# EAGLE design H10R4 (EAGLE 9.2.2)

## Sheet 1 of 2
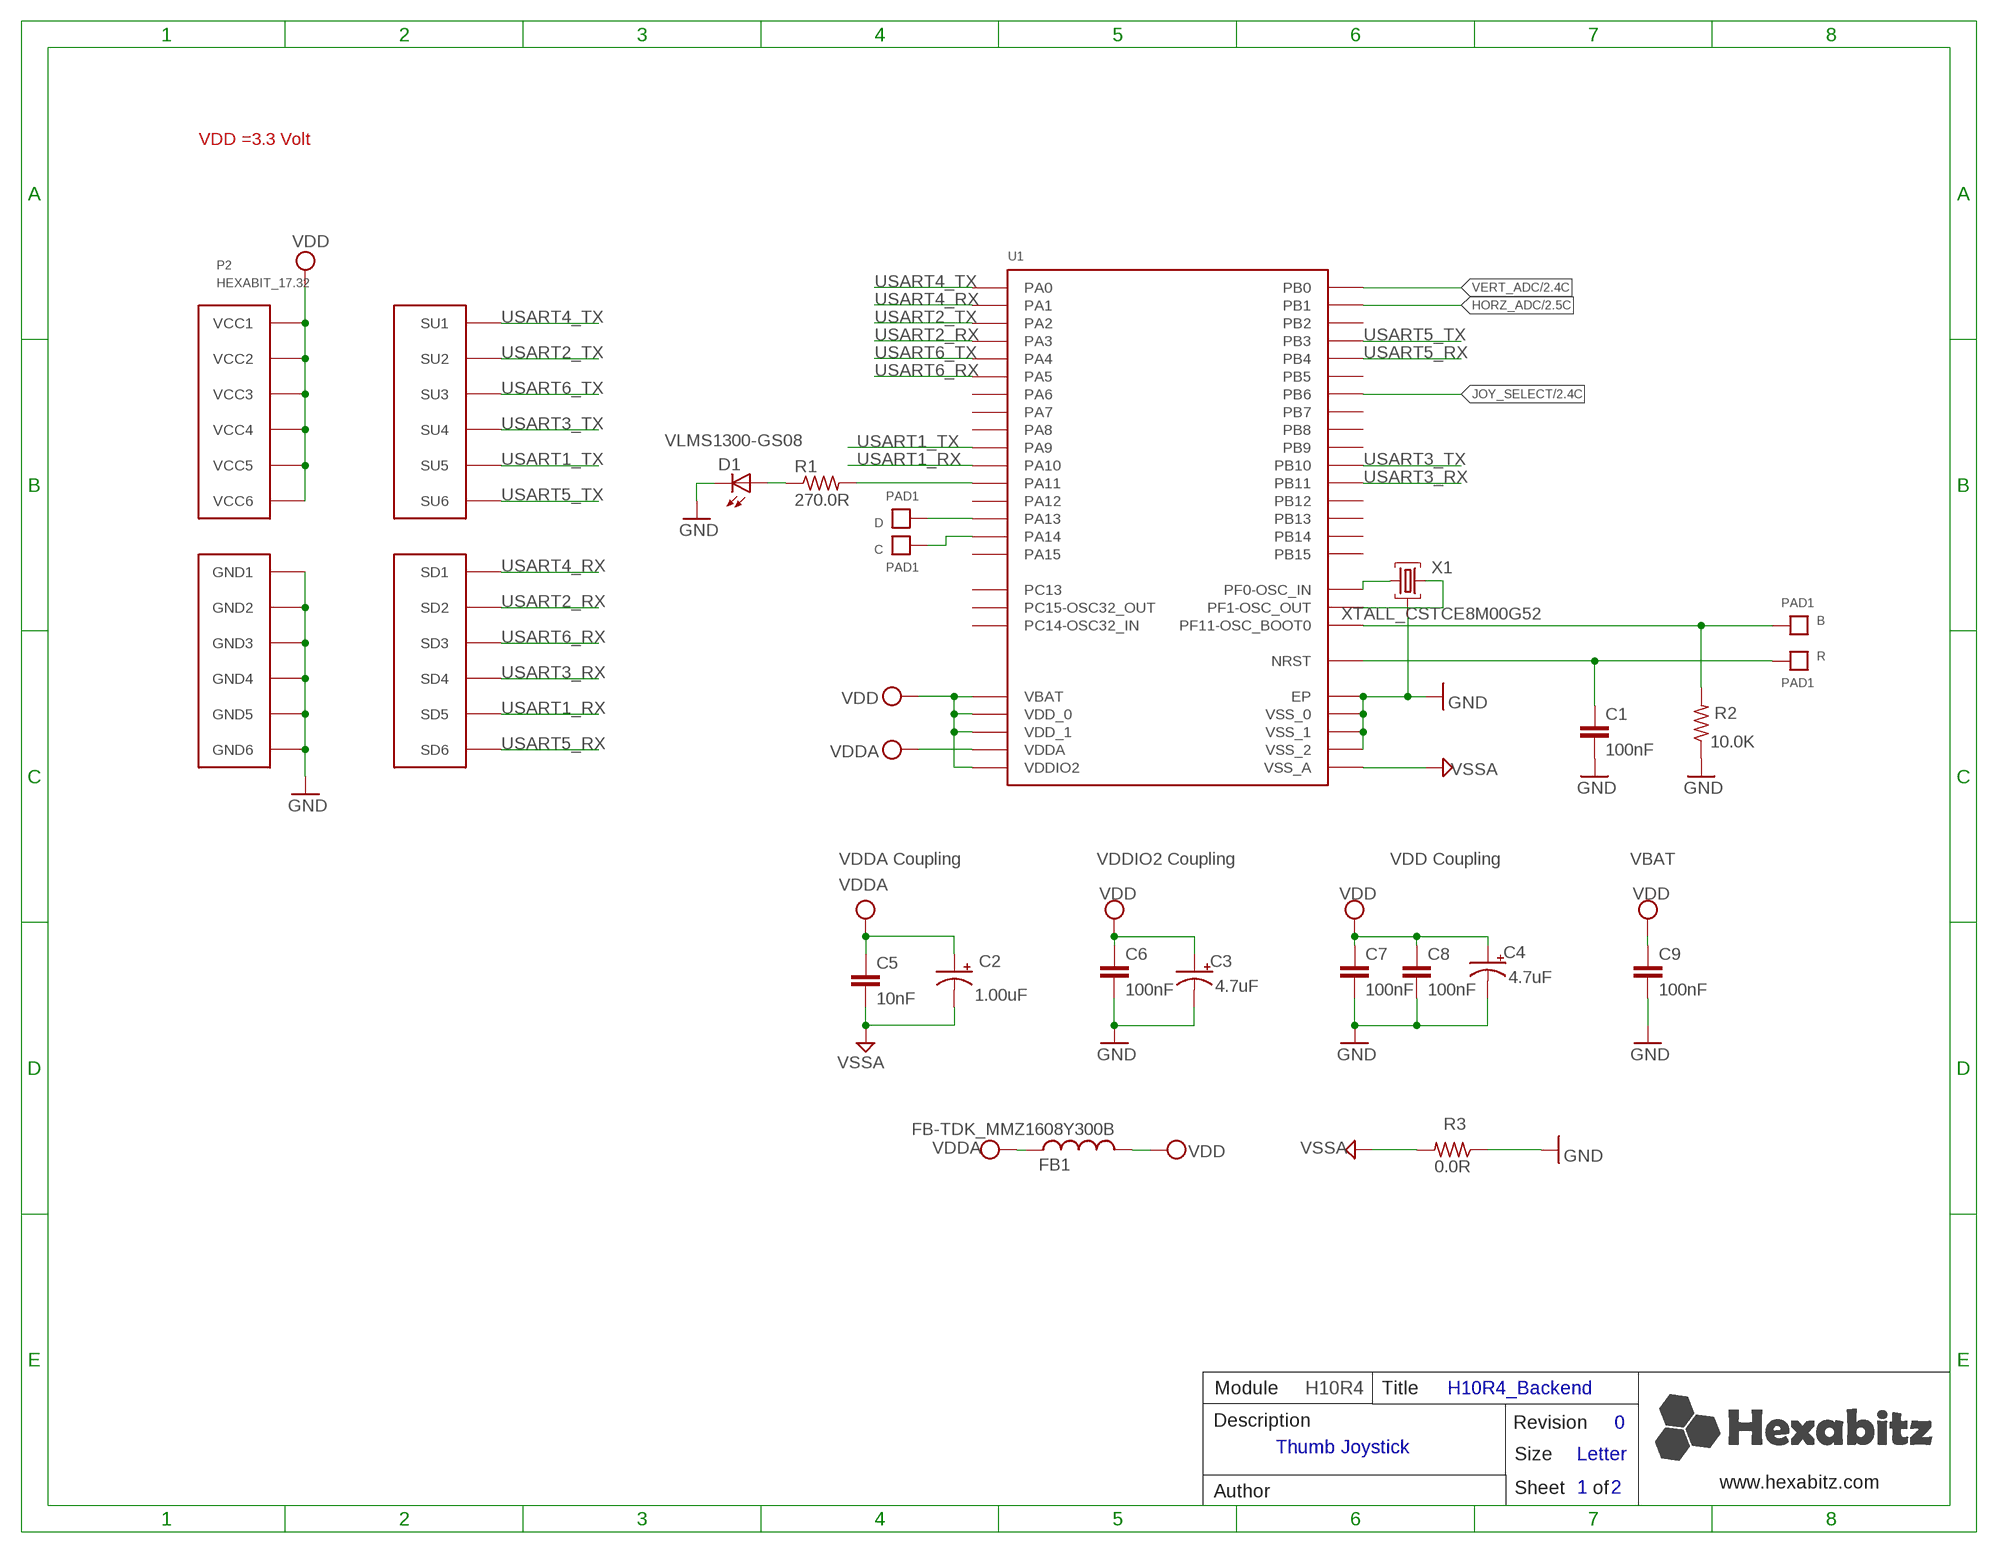
[diagram p0: schematic, sheet 1]

### Parts
B  PAD1  [PAD1]
C  PAD1  [PAD1]
C1  100nF  C-0603  [C-0603]
C2  1.00uF  C-0805-POL  [C-0805-POL]
C3  4.7uF  C-0805-POL  [C-0805-POL]
C4  4.7uF  C-0805-POL  [C-0805-POL]
C5  10nF  C-0603  [C-0603]
C6  100nF  C-0603  [C-0603]
C7  100nF  C-0603  [C-0603]
C8  100nF  C-0603  [C-0603]
C9  100nF  C-0603  [C-0603]
D  PAD1  [PAD1]
D1  VLMS1300-GS08  [VLMS1300-GS08]
FB1  FB-TDK_MMZ1608Y300B  [FB-TDK_MMZ1608Y300B]
P2  HEXABIT_17.32  [HEXABIT_17.32]
R  PAD1  [PAD1]
R1  270.0R  R-0603  [R-0603]
R2  10.0K  R-0603  [R-0603]
R3  0.0R  R-0603  [R-0603]
U1  STM32F091CBU6  [STM32F091CBU6]
X1  XTALL_CSTCE8M00G52  [XTALL_CSTCE8M00G52]

### Nets
B: B.P$1 B.P$2 R2.2 U1.P$44(PF11-OSC_BOOT0)
GND: C1.2 C3.2(-) C4.2(-) C6.2 C7.2 C8.2 C9.2 D1.C P2.7(GND1) P2.8(GND2) P2.9(GND3) P2.10(GND4) P2.11(GND5) P2.12(GND6) R2.1 R3.1 U1.EP U1.P$23(VSS_0) U1.P$35(VSS_1) U1.P$47(VSS_2) X1.P$2 ; also sheet 2
HORZ_ADC: U1.P$19(PB1) ; also sheet 2
JOY_SELECT: U1.P$42(PB6) ; also sheet 2
N$1: D.P$1 D.P$2 U1.P$34(PA13)
N$2: C.P$1 C.P$2 U1.P$37(PA14)
N$8: R1.2 U1.P$32(PA11)
N$10: D1.A R1.1
N$14: U1.P$5(PF0-OSC_IN) X1.P$1
N$15: U1.P$6(PF1-OSC_OUT) X1.P$3
R: C1.1 R.P$1 R.P$2 U1.P$7(NRST)
USART1_RX: P2.23(SD5) U1.P$31(PA10)
USART1_TX: P2.17(SU5) U1.P$30(PA9)
USART2_RX: P2.20(SD2) U1.P$13(PA3)
USART2_TX: P2.14(SU2) U1.P$12(PA2)
USART3_RX: P2.22(SD4) U1.P$22(PB11)
USART3_TX: P2.16(SU4) U1.P$21(PB10)
USART4_RX: P2.19(SD1) U1.P$11(PA1)
USART4_TX: P2.13(SU1) U1.P$10(PA0)
USART5_RX: P2.25(SD6) U1.P$40(PB4)
USART5_TX: P2.18(SU6) U1.P$39(PB3)
USART6_RX: P2.21(SD3) U1.P$15(PA5)
USART6_TX: P2.15(SU3) U1.P$14(PA4)
VDD: C3.1(+) C4.1(+) C6.1 C7.1 C8.1 C9.1 FB1.2 P2.1(VCC1) P2.2(VCC2) P2.3(VCC3) P2.4(VCC4) P2.5(VCC5) P2.6(VCC6) U1.P$1(VBAT) U1.P$24(VDD_0) U1.P$36(VDDIO2) U1.P$48(VDD_1)
VDDA: C2.1(+) C5.1 FB1.1 U1.P$9(VDDA) ; also sheet 2
VERT_ADC: U1.P$18(PB0) ; also sheet 2
VSSA: C2.2(-) C5.2 R3.2 U1.P$8(VSS_A) ; also sheet 2
Unconnected: U1.P$2(PC13) U1.P$3(PC14-OSC32_IN) U1.P$4(PC15-OSC32_OUT) U1.P$16(PA6) U1.P$17(PA7) U1.P$20(PB2) U1.P$25(PB12) U1.P$26(PB13) U1.P$27(PB14) U1.P$28(PB15) U1.P$29(PA8) U1.P$33(PA12) U1.P$38(PA15) U1.P$41(PB5) U1.P$43(PB7) U1.P$45(PB8) U1.P$46(PB9)

### Notes on the sheet
- VDD =3.3 Volt
- VDDA Coupling | VDDIO2 Coupling | VDD Coupling | VBAT
- Module | H10R4 | Title | H10R4_Backend
- Description | Revision | 0
- Thumb Joystick
- Size | Letter
- 1 | 2 | www.hexabitz.com
- Author | Sheet     of
- C:/Users/Admin/Desktop/logodraft.bmp

## Sheet 2 of 2
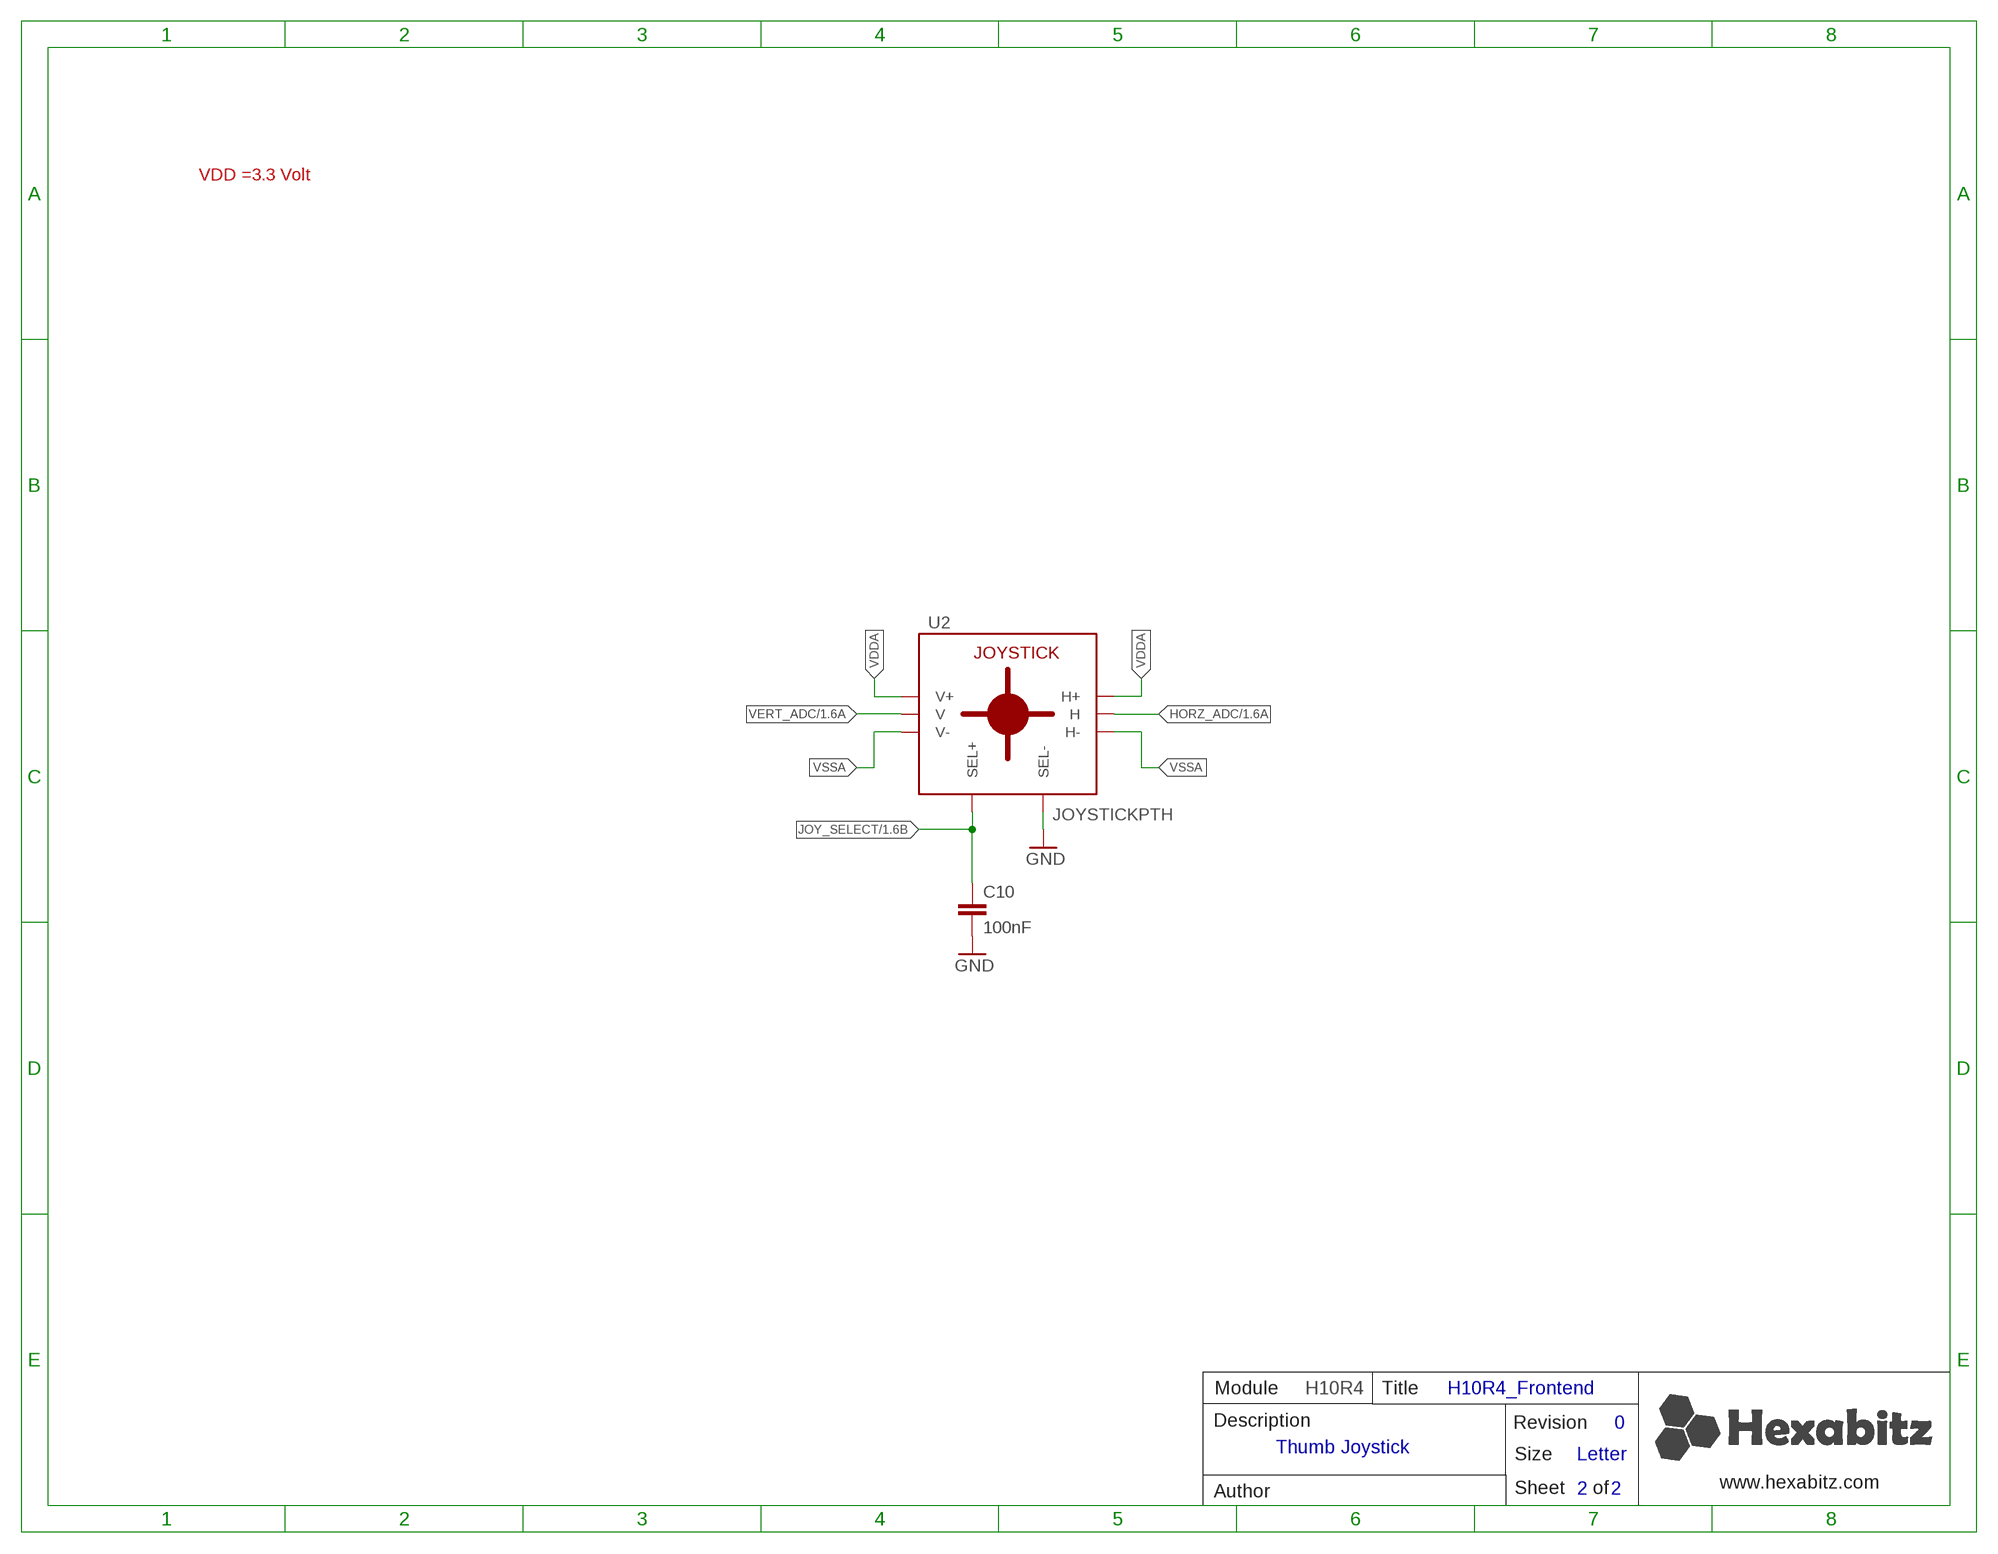
[diagram p1: schematic, sheet 2]

### Parts
C10  100nF  C-0603  [C-0603]
U2  JOYSTICKPTH  [JOYSTICK]

### Nets
GND: C10.2 U2.B2A(SEL-) ; also sheet 1
HORZ_ADC: U2.H2(H) ; also sheet 1
JOY_SELECT: C10.1 U2.B1A(SEL+) ; also sheet 1
VDDA: U2.H1(H+) U2.V1(V+) ; also sheet 1
VERT_ADC: U2.V2(V) ; also sheet 1
VSSA: U2.H3(H-) U2.V3(V-) ; also sheet 1

### Notes on the sheet
- VDD =3.3 Volt
- Module | H10R4 | Title | H10R4_Frontend
- Description | Revision | 0
- Thumb Joystick
- Size | Letter
- www.hexabitz.com
- Author | Sheet     of | 2 | 2
- C:/Users/Admin/Desktop/logodraft.bmp

## Library data of the parts
B C D R = Hexabitz:PAD1
C1 C6 C8 C10 = Hexabitz:C-0603: CAP CER 10% X7R 0603; CAPACITANCE: 100nF; MFN: KEMET; MPN: C0603C104K8RACTU; OCTOPART_URL: https://octopart.com/c0603c104k8ractu-kemet-145075?r=sp&s=9bS9ASSwSEqMCE9KBEQZ0g; TOLERANCE: 10%; VOLTAGE_RATING: 10V
C2 = Hexabitz:C-0805-POL: Cap Tant Solid SMD 2012; CAPACITANCE: 1.00uF; MFN: Yageo; MPN: CC0805KKX7R7BB105; OCTOPART_URL: https://octopart.com/cc0805kkx7r7bb105-yageo-8376555?r=sp&s=YKl1wwtkROau_X5nniH2ig; TOLERANCE: 10%; VOLTAGE_RATING: 16V
C3 C4 = Hexabitz:C-0805-POL: Cap Tant Solid SMD 2012; CAPACITANCE: 4.7uF; MFN: Murata; MPN: GRM21BC81E475KA12L; OCTOPART_URL: https://octopart.com/grm21bc81e475ka12l-murata-10331911?r=sp&s=RY3qZSD8T6mG6TC9CHI5qQ; TOLERANCE: 10%; VOLTAGE_RATING: 25V
C5 = Hexabitz:C-0603: CAP CER 10% X7R 0603; CAPACITANCE: 10nF; MFN: KEMET; MPN: C0603C103K5RACTU; OCTOPART_URL: https://octopart.com/c0603c103k5ractu-kemet-133094?r=sp&s=R_iPBxLnSmGqhkU2rIMFpg; TOLERANCE: 10%; VOLTAGE_RATING: 50V
C7 = Hexabitz:C-0603: CAP CER 10% X7R 0603; CAPACITANCE: 100nF; MFN: KEMET; MPN: C0603C104K8RACTU; OCTOPART_URL: https://octopart.com/c0603c104k8ractu-kemet-145075?r=sp&s=9bS9ASSwSEqMCE9KBEQZ0g; TOLERANCE: 10%; VOLTAGE_RATING: 10
C9 = Hexabitz:C-0603: CAP CER 10% X7R 0603; CAPACITANCE: 100nF; MFN: KEMET; MPN: C0603C104K8RACTU; OCTOPART_URL: https://octopart.com/c0603c104k8ractu-kemet-145075?r=sp&s=9bS9ASSwSEqMCE9KBEQZ0g; TOLERANCE: 10V; VOLTAGE_RATING: 10%
D1 = Hexabitz:VLMS1300-GS08: Red 0603 130° Clear 54 mcd 2 V Surface Mount ChipLED ; Octopart Url : http://octopart.com/vlms1300-gs08-vishay-21709201; MFN: Vishay; MPN: VLMS1300-GS08; OCTOPART_URL: https://octopart.com/vlms1300-gs08-vishay-21709201?r=sp&s=_gcP4_q8T1SC6PJQPTQ9yA
FB1 = Hexabitz:FB-TDK_MMZ1608Y300B: Ferrite Beads Multi-Layer 30Ohm 25% 100MHz 1.5A 50mOhm DCR 0603; MFN: TDK; MPN: MMZ1608Y300B; OCTOPART_URL: https://octopart.com/mmz1608y300b-tdk-368280?r=sp&s=cd9_2ZEqQ9q9UNBuQgHAiA
P2 = Hexabitz:HEXABIT_17.32: HEXABIT CONNECTOR
R1 = Hexabitz:R-0603: Thick Film Resistors - SMD 0603; MFN: Yageo; MPN: RC0603FR-07270RL; OCTOPART_URL: https://octopart.com/search?q=RC0603FR-07270RL&start=0; RESISTANCE: 270.0 Ohm; TOLERANCE: 1%
R2 = Hexabitz:R-0603: Thick Film Resistors - SMD 0603; MFN: Yageo; MPN: RC0603JR-0710KL; OCTOPART_URL: https://octopart.com/search?q=RC0603JR-0710KL&start=0; RESISTANCE: 10.0K Ohm; TOLERANCE: 5%
R3 = Hexabitz:R-0603: Thick Film Resistors - SMD 0603; MFN: Yageo; MPN: RC0603JR-070RL; OCTOPART_URL: https://octopart.com/rc0603jr-070rl-yageo-1241539?r=sp&s=X2NteqRjRNWrnx42Y0aliA; RESISTANCE: 0.0 Ohm
U1 = Hexabitz:STM32F091CBU6: Description : ARM-based 32-bit MCU, CAN, 12 timers, ADC, DAC & Comm. Interface, 2 to 3.6 V, -40 to 85 degC, 48-Pin UFQFPN, RoHS, Tray ;Parameter : Ciiva URL : https://ciiva.com/part/STM32F091CBU6-20240708, CiivaID : 20240708, Clock Speed : 48000000.0 Hz, Lifecycle Status : Active, Mounting Style : Surface Mount, Number of Pins : 48, Octopart Url : https://octopart.com/stm32f091cbu6-stmicroelectronics-51988677, OctopartID : 5f4f955c32ec8088, RAM Memory Size : 32768 B, REACH SVHC Compliance : No SVHC, RoHS : Compliant,; MFN: STMicroelectronics; MPN: STM32F091CBU6; OCTOPART_URL: https://octopart.com/stm32f091cbu6-stmicroelectronics-51988677?r=sp&s=bU6fpgsrTZOxHyt7jkfh3w
U2 = Hexabitz:JOYSTICK: Thumb Joystick Joystick commonly found in PS2 controllers. Two pots and a select switch. Footprint proven. Spark Fun Electronics SKU : COM-09032; MFN: SparkFun; MPN: COM-09032; OCTOPART_URL: https://octopart.com/search?q=COM-09032&start=0
X1 = Hexabitz:XTALL_CSTCE8M00G52: MURATA CSTCE8M00G52-R0 RESONATOR, SMD, 8MHZ ; Octopart Url : https://octopart.com/cstce8m00g52-r0-murata-7145559; MFN: Murata; MPN: CSTCE8M00G52Z-R0; OCTOPART_URL: https://octopart.com/cstce8m00g52z-r0-murata-17755941?r=sp&s=JDnNJnrHQhyS8Zk4ofFWXw

## Board
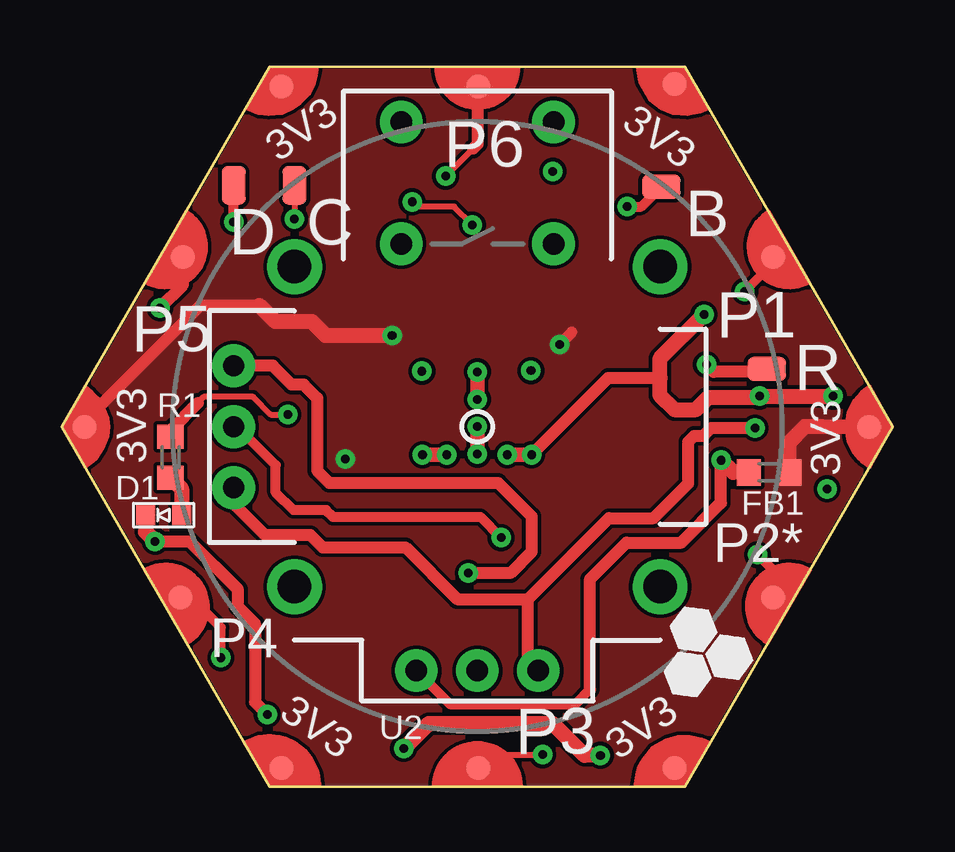
[diagram p2: board, top side]
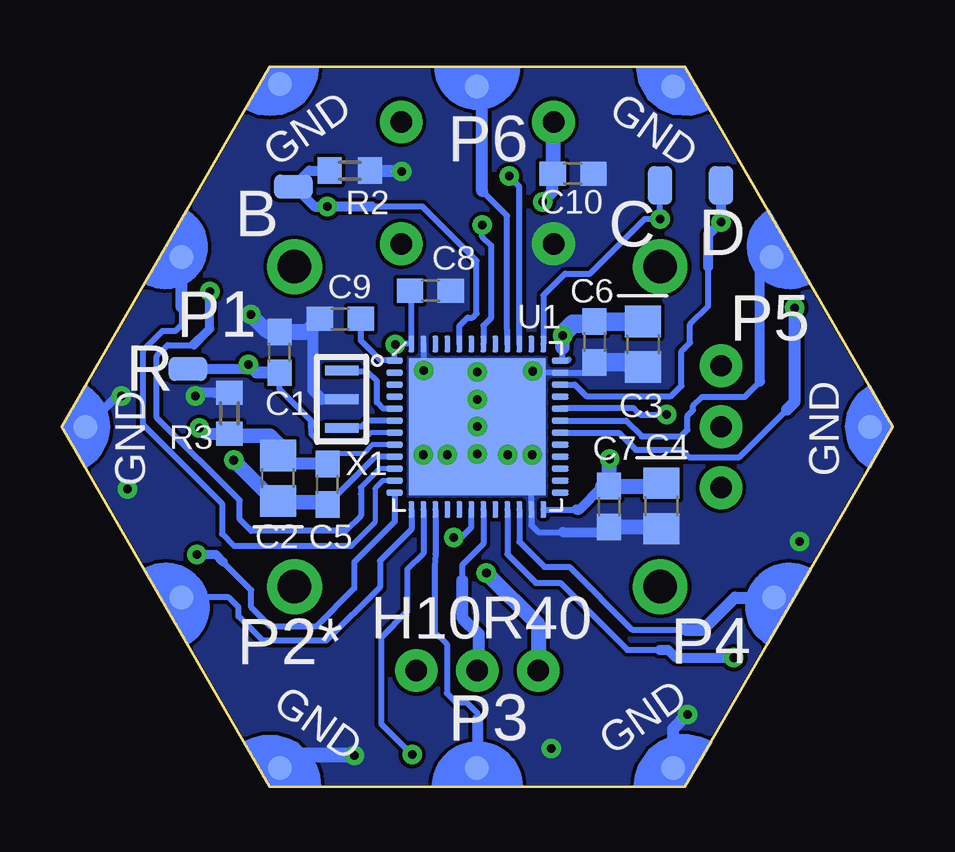
[diagram p3: board, bottom side, seen from below]

Size 34.64 x 30 mm. Coordinates in mm from the lower left corner, seen from the top.
Copper layers (1*16): Top 0.035mm / dielectric 1.5mm / Bottom 0.035mm
Design rules "default *": minimum track width 7mil, minimum drill 10mil, track to track 6mil, track to pad 6mil, pad to pad 6mil, via to via 6mil, smd to smd 0mil, copper to edge 1mil, drill to drill 8mil, minimum pad ring 10mil, minimum via ring 8mil, stop-mask expansion 2mil, vias tented up to drill 15mil, thermal gap 10mil

### Footprints (pad centres in the part's own frame; a part is rotated, then mirrored left to right if it is on the bottom)
PAD1 = smd 1.6 x 1: P$1 0,0 | smd 1.6 x 1 bottom: P$2 0,0
C-0603 = smd 1.1 x 1: 1 -0.85,0; 2 0.85,0
C-0805-POL = smd 1.3 x 1.5: 1 -0.95,0; 2 0.95,0
VLMS1300-GS08 = smd 0.8 x 0.8: A 0,0.75; C 0,-0.75
FB-TDK_MMZ1608Y300B = smd 1 x 1.1: 1 -0.85,0; 2 0.85,0
HEXABIT_17.32 = smd 1 x 1: 1 8.23,14.28; 2 16.33,-0.02; 3 8.23,-14.22; 4 -8.17,-14.22; 5 -16.37,-0.02; 6 -8.17,14.18; 13 12.33,7.08; 14 12.33,-7.12; 15 0.03,-14.22; 16 -12.37,-7.12; 17 -12.27,7.08; 18 0.03,14.18 | smd 1 x 1 bottom: 7 8.23,14.28; 8 16.33,-0.02; 9 8.23,-14.22; 10 -8.17,-14.22; 11 -16.37,-0.02; 12 -8.17,14.18; 19 12.33,7.08; 20 12.33,-7.12; 21 0.03,-14.22; 22 -12.37,-7.12; 23 -12.27,7.08; 25 0.03,14.18
R-0603 = smd 1 x 1.1: 1 -0.85,0; 2 0.85,0
STM32F091CBU6 = smd 5.7 x 5.7: EP 0,0 | smd 0.25 x 0.7: P$1 -2.75,-3.45; P$2 -2.25,-3.45; P$3 -1.75,-3.45; P$4 -1.25,-3.45; P$5 -0.75,-3.45; P$6 -0.25,-3.45; P$7 0.25,-3.45; P$8 0.75,-3.45; P$9 1.25,-3.45; P$10 1.75,-3.45; P$11 2.25,-3.45; P$12 2.75,-3.45; P$25 2.75,3.45; P$26 2.25,3.45; P$27 1.75,3.45; P$28 1.25,3.45; P$29 0.75,3.45; P$30 0.25,3.45; P$31 -0.25,3.45; P$32 -0.75,3.45; P$33 -1.25,3.45; P$34 -1.75,3.45; P$35 -2.25,3.45; P$36 -2.75,3.45 | smd 0.7 x 0.25: P$13 3.45,-2.75; P$14 3.45,-2.25; P$15 3.45,-1.75; P$16 3.45,-1.25; P$17 3.45,-0.75; P$18 3.45,-0.25; P$19 3.45,0.25; P$20 3.45,0.75; P$21 3.45,1.25; P$22 3.45,1.75; P$23 3.45,2.25; P$24 3.45,2.75; P$37 -3.45,2.75; P$38 -3.45,2.25; P$39 -3.45,1.75; P$40 -3.45,1.25; P$41 -3.45,0.75; P$42 -3.45,0.25; P$43 -3.45,-0.25; P$44 -3.45,-0.75; P$45 -3.45,-1.25; P$46 -3.45,-1.75; P$47 -3.45,-2.25; P$48 -3.45,-2.75
JOYSTICK = drill 0.9 pad 1.778: B1A -3.175,12.7; B1B 3.175,12.7; B2A -3.175,7.62; B2B 3.175,7.62 | drill 0.889 pad 1.778: H1 -2.54,-10.16; H2 0,-10.16; H3 2.54,-10.16; V1 -10.16,2.54; V2 -10.16,0; V3 -10.16,-2.54 | drill 1.397 pad 2.286: MOUNT1 -7.62,6.668; MOUNT2 -7.62,-6.668; MOUNT3 7.62,-6.668; MOUNT4 7.62,6.668
XTALL_CSTCE8M00G52 = smd 1.4 x 0.4: P$1 0,1.2; P$2 0,0; P$3 0,-1.2

### Placement (x,y rotation side)
B  24.99,25.01 0 top
C  9.7,25.06 270 top
C1  25.57,18.1 90 bottom
C2  25.63,12.85 90 bottom
C3  10.41,18.44 270 bottom
C4  9.65,11.7 270 bottom
C5  23.57,12.6 90 bottom
C6  12.44,18.53 270 bottom
C7  11.83,11.67 270 bottom
C8  19.28,20.66 0 bottom
C9  23.04,19.5 180 bottom
C10  13.33,25.54 0 bottom
D  7.16,25.06 90 top
D1  4.24,11.32 270 top
FB1  29.48,13.1 0 top
P2  17.32,15 0 top
R  29.39,17.41 0 top
R1  4.53,13.73 90 top
R2  22.64,25.67 180 bottom
R3  27.66,15.56 270 bottom
U1  17.32,15 270 bottom
U2  17.32,15 0 top
X1  22.98,16.14 0 bottom

### Tracks (layer width: path | path; a pad name or v marks a point on that pad's centre or on a via)
B  (via drill 0.36 pad 0.81)
  Top 0.406: v23.57,24.17 24.15,24.17 B.P$1
  Bottom 0.254: U1.P$44 18.07,19.2 17.73,19.55 17.52,19.55 17.34,19.72 17.34,21.91 19.61,24.17 21.71,24.17
  Bottom 0.406: R2.2 24.33,25.67 B.P$1 24.94,25.01 24.1,24.17 v23.57,24.17 21.71,24.17
  Bottom 0.508: B.P$1 arc90 24.96,24.98
GND  (via drill 0.36 pad 0.81)
  Top 0.508: v3.88,10.22 5.33,10.22 7.34,8.22 7.34,7.51 8.05,6.8 8.05,3.52 v8.56,3.01 | v19.58,13.83 22.78,17.03 24.94,17.03
  Top 0.61: v17.32,13.86 U1.EP | v17.32,16.14 v17.32,17.29 | v15.03,13.83 v16.05,13.83 | v19.58,13.83 v18.57,13.83
  Top 0.635: D1.C 3.49,10.62 v3.88,10.22 | v26.77,19.67 24.94,17.84 24.94,17.03 24.94,16.3 25.52,15.71 26.44,15.71 26.95,16.22 29.03,16.22 v29.08,16.27 v32.15,16.27 | v22.45,1.31 21.79,1.31 20.47,2.63 15.29,2.63 v14.25,1.59
  Bottom 0.254: U1.P$47 19.57,17.25 U1.EP | v15.03,13.83 15,17.25 U1.P$35 12.62,17.25 C6.2 | v16.05,13.83 16.3,17.29 | v17.32,13.86 16.68,13.22 15.29,13.22 15.07,13 U1.P$23 15.07,10.9 14.78,10.61 13.76,10.61
  Bottom 0.356: X1.P$2 23.8,16.14
  Bottom 0.381: R3.1 28.26,16.41 | v32.15,16.27 32.36,16.27 P2.8
  Bottom 0.406: 13.76,10.61 12.05,10.61 C7.2 | 28.26,16.41 28.94,16.41 v29.08,16.27
  Bottom 0.457: 23.8,16.14 24.18,16.52 24.18,19.2 C9.2 | 19.57,17.25 19.39,17.25 v19.58,13.83 | v18.57,13.83 18.08,17.29
  Bottom 0.508: P2.10 9.15,2.42 v8.56,3.01 | R2.1 20.5,25.67 v20.47,25.64
  Bottom 0.61: 24.99,18.94 C1.2 | v17.32,13.86 U1.EP v17.32,16.14 | v17.32,17.29 16.3,17.29
  Bottom 0.635: C7.2 9.82,10.82 C4.2 | 24.99,18.94 24.44,18.94 C9.2 23.89,19.48 24.41,18.96 26.06,18.96 v26.77,19.67 | v22.45,1.31 25.02,1.31 P2.9
  Bottom 0.762: 10.47,17.4 C3.2 10.58,17.68 C6.2
  other vias: 17.32,15 19.56,17.34 31.9,12.41 15.01,17.31
  pour Bottom (no thermals): 0.05,15 8.68,29.99 25.96,29.99 34.59,15 25.96,0.01 8.68,0.01
HORZ_ADC
  Bottom 0.254: U1.P$19 17.07,10.12 17.95,9.23 17.95,8.6
  Bottom 0.508: 17.95,8.6 17.95,7.05 17.27,6.36 17.27,4.89 U2.H2
JOY_SELECT  (via drill 0.36 pad 0.81)
  Top 0.254: v17.12,23.41 16.36,24.17 14.8,24.17 v14.6,24.37
  Bottom 0.254: v17.12,23.41 17.12,22.93 16.74,22.54 16.74,19.55 17.07,19.22 U1.P$42
  Bottom 0.508: v14.6,24.37 14.18,24.79 C10.1
  Bottom 0.635: C10.1 14.14,25.58 U2.B1A
N$1  (via drill 0.36 pad 0.81)
  Top 0.406: v7.16,23.53 D.P$1
  Bottom 0.254: 7.69,21.66 7.69,20.03 8.46,19.27 8.46,18.5 8.81,18.15 8.81,16.7 9.24,16.27 12.77,16.27 13.25,16.75 U1.P$34
  Bottom 0.406: 7.69,21.66 7.69,23 v7.16,23.53 D.P$1
N$2  (via drill 0.36 pad 0.81)
  Top 0.254: C.P$1 v9.7,23.66
  Bottom 0.254: C.P$1 v9.7,23.66 10.34,23.66 12.62,21.38 13.66,21.38 14.57,20.47 U1.P$37
N$8  (via drill 0.36 pad 0.81)
  Top 0.254: 5.66,15.99 5.92,16.25 7.97,16.25 8.71,15.51 v9.42,15.51
  Top 0.508: 5.66,15.99 4.53,14.86 R1.2
  Bottom 0.254: U1.P$32 13.86,15.76 10.79,15.76 10.54,15.51 v9.42,15.51
N$10
  Top 0.635: R1.1 4.99,12.42 D1.A
N$14
  Bottom 0.254: U1.P$5 21.25,15.75 21.51,16.02 21.51,16.91 21.89,17.29 22.92,17.29 X1.P$1
N$15
  Bottom 0.254: U1.P$6 21.9,15.25 22.15,15 22.92,15 X1.P$3
R  (via drill 0.36 pad 0.81)
  Top 0.406: 29.26,17.29 R.P$1
  Top 0.508: 29.26,17.29 27.18,17.29 v26.87,17.59
  Bottom 0.203: U1.P$7 21.76,14.75 22.09,14.42 23.98,14.42 24.25,14.7 24.25,14.97
  Bottom 0.254: 26.91,17.45 v26.87,17.59 | 24.25,14.97 24.25,15.25 25.57,16.57 C1.1
  Bottom 0.406: R.P$1 27.05,17.41 v26.87,17.59
  Bottom 0.508: C1.1 26.53,17.25 v26.87,17.59
USART1_RX
  Bottom 0.254: U1.P$31 11.12,15.25 10.46,14.59 8.84,14.59 8.56,14.87 8.56,15.46 8.33,15.69 8.33,15.86 7.95,16.25 6.17,16.25 5.53,16.88
  Bottom 0.406: 5.53,16.88 5.53,21.6 5.05,21.6
  Bottom 0.508: P2.23 5.05,21.6
USART1_TX  (via drill 0.36 pad 0.81)
  Top 0.254: 4.84,22.08 P2.17
  Top 0.457: 4.84,22.08 4.37,21.6
  Top 0.508: v4.09,19.95 5.05,20.92 P2.17
  Bottom 0.254: U1.P$30 11.43,14.75 10.72,14.04 8.81,14.04 8.51,13.73 6.4,13.73 4.42,15.71
  Bottom 0.508: 4.42,15.71 4.09,16.04 v4.09,19.95
USART2_RX
  Bottom 0.254: U1.P$13 20.07,10.73 21.38,9.41 21.38,8.32 23.62,6.08 26.26,6.08 27.28,7.1 27.28,7.48 27.68,7.89 P2.20
  Bottom 0.406: P2.20 29.48,7.88 29.48,7.71
USART2_TX  (via drill 0.36 pad 0.81)
  Top 0.406: v29,9.67 29.65,9.02 P2.14
  Bottom 0.254: U1.P$12 20.77,11.04 22.45,9.36 22.45,8.27 24.05,6.67 25.93,6.67 26.74,7.48 26.74,8.19 27.91,9.36
  Bottom 0.381: 27.91,9.36 28.22,9.67 v29,9.67
USART3_RX
  Bottom 0.254: U1.P$22 15.57,10.2 14.53,9.16 13.48,9.16 10.87,6.54 8.66,6.54
  Bottom 0.508: 4.95,8.14 P2.22 6.58,7.88 7.91,6.54 8.66,6.54
USART3_TX  (via drill 0.36 pad 0.81)
  Top 0.406: 4.95,7.79 5.23,7.51 5.23,7.58 4.98,7.84 | 4.98,7.84 4.99,7.84 | 4.98,7.84 4.95,7.84 | v6.63,5.37 6.63,6.64 5.39,7.88 P2.16
  Top 0.508: P2.16 4.95,7.84
  Bottom 0.254: U1.P$21 16.07,9.69 14.88,8.5 13.87,8.5 11.07,5.7 9.72,5.7
  Bottom 0.406: 9.72,5.7 9.37,5.7 9.04,5.37 v6.63,5.37
USART4_RX
  Bottom 0.203: U1.P$11 21.27,12.75 21.59,12.44 21.59,11.01 22.58,10.02
  Bottom 0.254: 22.58,10.02 27.45,10.02 27.96,10.53 27.96,11.8 31.27,15.1 31.27,18.18 30.45,18.99 29.92,18.99 29.65,19.26 29.65,20.02
  Bottom 0.508: 29.65,20.02 P2.19
USART4_TX  (via drill 0.36 pad 0.81)
  Top 0.381: v28.47,20.64 29.65,21.82
  Top 0.508: 29.65,21.82 P2.13
  Bottom 0.203: U1.P$10 21.41,13.25 22.17,12.48 22.17,12.21
  Bottom 0.254: 22.17,12.46 22.17,12.21 22.17,11.29 22.81,10.66 26.74,10.66 27.23,11.14 27.23,11.93 30.68,15.38 30.68,17.95 30.22,18.4 29.16,18.4 29.13,18.43
  Bottom 0.381: v28.47,20.64 28.47,19.09 28.95,18.61
  Bottom 0.406: 28.95,18.61 29.13,18.43
USART5_RX
  Bottom 0.254: U1.P$40 16.07,19.03 16.07,19.04 16.07,23.79 17.12,24.83
  Bottom 0.508: 17.12,24.83 17.12,28.95 P2.25
USART5_TX  (via drill 0.36 pad 0.81)
  Top 0.254: v16,25.44 17.14,26.58
  Top 0.508: 17.14,26.58 17.34,26.79 P2.18
  Bottom 0.254: U1.P$39 15.57,24.81 | 15.57,24.8 15.57,24.81 | 15.57,24.81 15.57,25.01 v16,25.44
USART6_RX
  Bottom 0.254: U1.P$15 19.07,9.69 19.1,9.16 19.1,6.44 18.59,5.93 18.59,3.9 18.21,3.52 17.78,3.52 17.32,3.06 17.32,2.81 | 17.32,0.81 P2.21
  Bottom 0.406: 17.32,0.81 17.35,0.81
  Bottom 0.457: 17.32,2.81 17.32,0.81
USART6_TX  (via drill 0.36 pad 0.81)
  Top 0.254: P2.15 17.91,1.33 v20.04,1.33
  Bottom 0.254: U1.P$14 19.57,9.73 20.24,9.06 20.24,7.3 21.33,6.21 21.33,2.63 v20.04,1.33
VDD  (via drill 0.36 pad 0.81)
  Top 0.457: v20.75,18.43 21.26,18.94
  Top 0.508: 1.55,14.98 1.42,15.11 1.42,15.69 5.79,20.05 8.23,20.05
  Top 0.61: 31.67,15 33.63,15
  Top 0.635: 31.67,15 30.96,15 30.3,14.34 30.3,13.13 FB1.2 | v13.76,18.81 10.99,18.81 C3.1 8.9,19.39 8.23,20.05
  Bottom 0.254: 13.51,17.79 13.55,17.75 U1.P$36 13.76,17.86 v13.76,18.81 | U1.P$24 13.2,11.55 | C9.1 22.18,18.59 21.38,17.79 20.81,17.79 U1.P$1 20.77,18.41 v20.75,18.43 20.73,18.45 U1.P$48 20.07,20.47 C8.1
  Bottom 0.406: 13.2,11.55 13.07,11.55 12.1,12.52 C7.1
  Bottom 0.61: 13.76,18.3 v13.76,18.81
  Bottom 0.635: C7.1 9.67,12.52 C4.1 | 12.1,12.52 11.81,12.82 v11.81,13.65
  Bottom 0.762: C6.1 12.35,19.22 | 10.55,19.22 C3.1 10.39,19.38 C6.1 | v13.76,18.81 13.76,18.86 13.33,19.29 12.53,19.29 C6.1
  pour Top (no thermals): 8.68,29.99 0.05,15 8.68,0.01 25.96,0.01 34.59,15 25.96,29.99
VDDA  (via drill 0.36 pad 0.81)
  Top 0.406: U2.H1 16.18,3.44 21.41,3.44 22.02,4.05
  Top 0.508: 22.02,4.05 22.02,8.65 23.54,10.17 25.83,10.17 27.48,11.82 v27.48,13.6 | U2.V1 8.79,17.54 9.57,16.75 10.08,16.75 10.64,16.19 10.64,13.17 11.15,12.66 18.18,12.66 19.58,11.27 19.58,9.79 18.69,8.9 v16.94,8.9
  Top 0.635: FB1.1 27.99,13.1 v27.48,13.6
  Bottom 0.254: U1.P$9 21.59,13.75 23.49,11.85 C5.1
  Bottom 0.61: v27.48,13.6 25.86,11.98 C2.1 24.9,11.85 23.57,11.85 C5.1
  Bottom 0.635: v16.94,8.9 14.78,6.75 U2.H1
VERT_ADC  (via drill 0.36 pad 0.81)
  Top 0.406: v18.31,10.38 17.45,11.24 11.3,11.24 11.02,11.52 9.65,11.52 8.91,12.26 8.91,13.4 7.31,15 U2.V2
  Bottom 0.254: v18.31,10.38 18.01,10.38 17.57,10.81 U1.P$18
VSSA  (via drill 0.36 pad 0.81)
  Top 0.508: 19.43,7.81 16.48,7.81 14.32,9.97 10.87,9.97 10.36,10.48 8.48,10.48 7.16,11.8 U2.V3 | 19.43,7.81 22.81,11.19 24.66,11.19 26.11,12.64 26.11,14.37 26.36,14.62 26.74,14.62 27.07,14.95 v28.9,14.95 | U2.H3 19.43,5.27 19.43,7.81
  Bottom 0.203: U1.P$8 21.7,14.25 22.07,13.88 23.29,13.88 C5.2
  Bottom 0.508: C5.2 25.63,13.45 C2.2 | v28.9,14.95 28.66,14.71 R3.2
  Bottom 0.61: C2.2 25.22,13.88 25.96,14.62 27.73,14.62 R3.2

### Text on the board
tNames: 3V3 | 3V3 | P6 | P1 | P5 | 3V3 | 3V3 | P2* | P4 | 3V3 | P3 | 3V3
bNames: GND | P6 | GND | B | D | C | P5 | P1 | R | GND | GND | P4 | P2* | H10R40 | P3 | GND | GND
LayerStack: Total Thickness 1.6 mm / --------------------------------------------------------- / / copper_top.gbr : Top Conductor - Copper: Thickness 0.035 mm / / Dielectric - FR-4: / / copper_bottom.gbr : Bottom Conductor - Copper: Thickness 0.035 mm